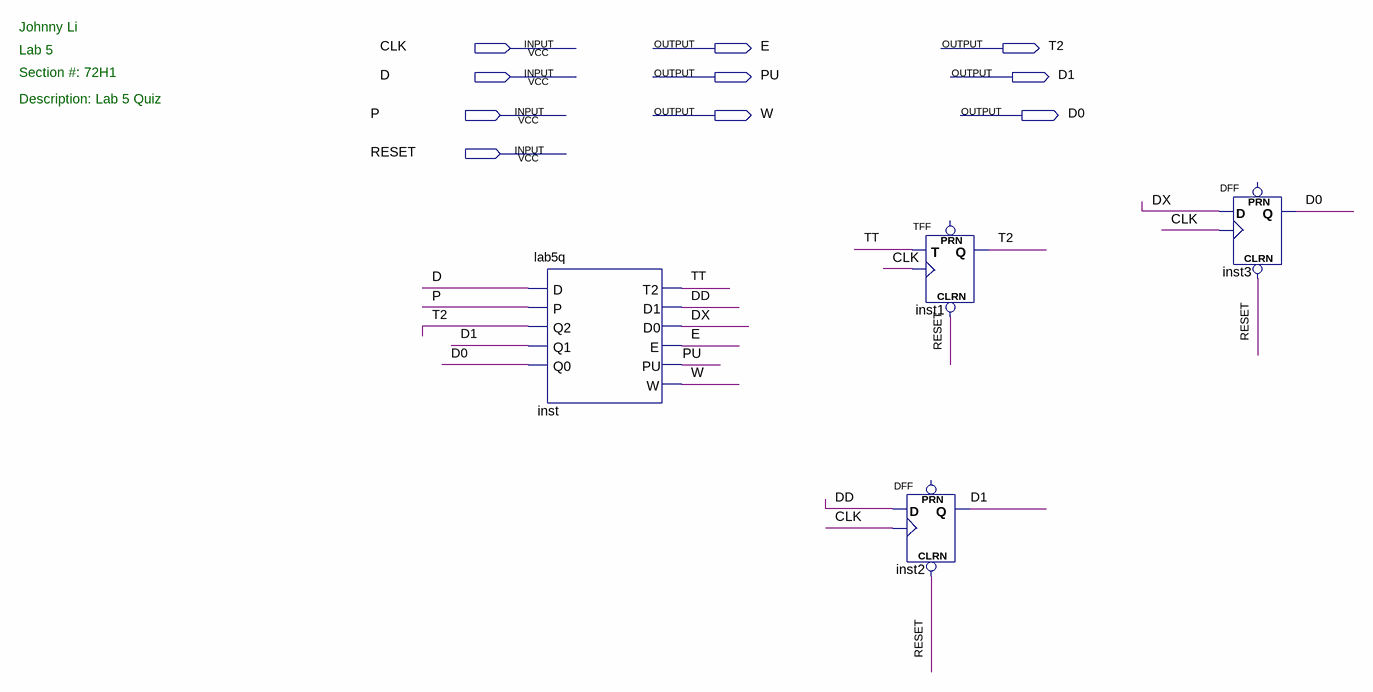
[diagram p0: schematic sheet]
// Quartus schematic lab5quiz.bdf as structural Verilog: 4 symbols, 10 pins
module lab5quiz (
  input  CLK,
  input  D,
  input  P,
  input  RESET,
  output E,
  output T2,
  output PU,
  output D1,
  output W,
  output D0
);

  wire DD, DX, TT;

  lab5q inst (.D(D), .P(P), .Q2(T2), .Q1(D1), .Q0(D0), .T2(TT), .D1(DD), .D0(DX), .E(E), .PU(PU), .W(W));
  DFF inst2 (.CLRN(RESET), .CLK(CLK), .D(DD), .Q(D1));  // open: PRN
  TFF inst1 (.CLRN(RESET), .T(TT), .CLK(CLK), .Q(T2));  // open: PRN
  DFF inst3 (.CLRN(RESET), .CLK(CLK), .D(DX), .Q(D0));  // open: PRN

  // Notes on the sheet:
  //   Johnny Li 
  //   Lab 5 
  //   Section #: 72H1
  //   Description: Lab 5 Quiz
endmodule
